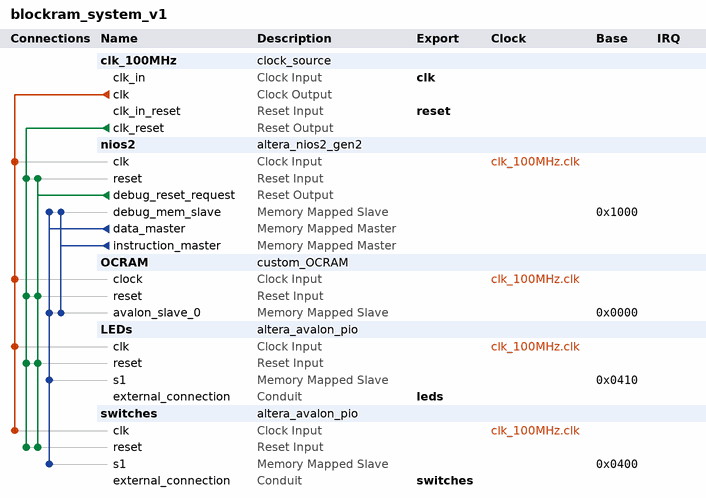
[diagram p0: system contents]
# Platform Designer (Qsys) system blockram_system_v1, Cyclone 10 LP 10CL025YE144C8G
# Parameters at their usual value, and those the tool derives, are not listed.
package require -exact qsys 22.1
create_system blockram_system_v1
set_project_property DEVICE_FAMILY {Cyclone 10 LP}
set_project_property DEVICE 10CL025YE144C8G

add_instance clk_100MHz clock_source 22.1
set_instance_parameter_value clk_100MHz clockFrequency 50000000

add_instance nios2 altera_nios2_gen2 22.1
set_instance_parameter_value nios2 dcache_size 2048
set_instance_parameter_value nios2 exceptionSlave OCRAM.avalon_slave_0
set_instance_parameter_value nios2 icache_size 4096
set_instance_parameter_value nios2 impl Tiny
set_instance_parameter_value nios2 resetSlave OCRAM.avalon_slave_0

add_instance OCRAM custom_OCRAM 1.0

add_instance LEDs altera_avalon_pio 22.1
set_instance_parameter_value LEDs direction Output
set_instance_parameter_value LEDs width 4

add_instance switches altera_avalon_pio 22.1
set_instance_parameter_value switches direction Input
set_instance_parameter_value switches width 4

# connections
add_connection clk_100MHz.clk LEDs.clk clock
add_connection clk_100MHz.clk nios2.clk clock
add_connection clk_100MHz.clk OCRAM.clock clock
add_connection clk_100MHz.clk switches.clk clock
add_connection clk_100MHz.clk_reset LEDs.reset reset
add_connection clk_100MHz.clk_reset nios2.reset reset
add_connection clk_100MHz.clk_reset OCRAM.reset reset
add_connection clk_100MHz.clk_reset switches.reset reset
add_connection nios2.debug_reset_request LEDs.reset reset
add_connection nios2.debug_reset_request nios2.reset reset
add_connection nios2.debug_reset_request OCRAM.reset reset
add_connection nios2.debug_reset_request switches.reset reset
add_connection nios2.data_master LEDs.s1 avalon
set_connection_parameter_value nios2.data_master/LEDs.s1 baseAddress 0x0410
add_connection nios2.data_master nios2.debug_mem_slave avalon
set_connection_parameter_value nios2.data_master/nios2.debug_mem_slave baseAddress 0x1000
add_connection nios2.data_master OCRAM.avalon_slave_0 avalon
set_connection_parameter_value nios2.data_master/OCRAM.avalon_slave_0 baseAddress 0x0000
add_connection nios2.data_master switches.s1 avalon
set_connection_parameter_value nios2.data_master/switches.s1 baseAddress 0x0400
add_connection nios2.instruction_master nios2.debug_mem_slave avalon
set_connection_parameter_value nios2.instruction_master/nios2.debug_mem_slave baseAddress 0x1000
add_connection nios2.instruction_master OCRAM.avalon_slave_0 avalon
set_connection_parameter_value nios2.instruction_master/OCRAM.avalon_slave_0 baseAddress 0x0000

# exported interfaces
add_interface clk clock sink
set_interface_property clk EXPORT_OF clk_100MHz.clk_in
add_interface leds conduit end
set_interface_property leds EXPORT_OF LEDs.external_connection
add_interface reset reset sink
set_interface_property reset EXPORT_OF clk_100MHz.clk_in_reset
add_interface switches conduit end
set_interface_property switches EXPORT_OF switches.external_connection

set_interconnect_requirement {$system} qsys_mm.clockCrossingAdapter HANDSHAKE
set_interconnect_requirement {$system} qsys_mm.enableEccProtection FALSE
set_interconnect_requirement {$system} qsys_mm.insertDefaultSlave FALSE
set_interconnect_requirement {$system} qsys_mm.maxAdditionalLatency 1

save_system blockram_system_v1.qsys
